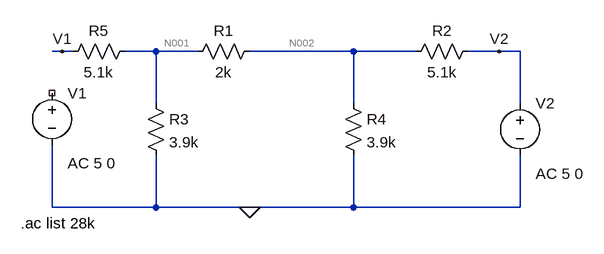
[diagram p0: schematic Draft1.asc]
Draft1.asc, the LTspice schematic file:
Version 4
SHEET 1 880 680
WIRE -32 48 -48 48
WIRE -16 48 -32 48
WIRE 112 48 64 48
WIRE 176 48 112 48
WIRE 416 48 256 48
WIRE 512 48 416 48
WIRE 640 48 592 48
WIRE 672 48 640 48
WIRE 112 128 112 48
WIRE 416 128 416 48
WIRE 672 128 672 48
WIRE -48 288 -48 192
WIRE 112 288 112 208
WIRE 112 288 -48 288
WIRE 256 288 112 288
WIRE 416 288 416 208
WIRE 416 288 256 288
WIRE 672 288 672 208
WIRE 672 288 416 288
FLAG 256 288 0
FLAG -32 48 V1
FLAG 640 48 V2
SYMBOL res 272 32 R90
WINDOW 0 0 56 VBottom 2
WINDOW 3 32 56 VTop 2
SYMATTR InstName R1
SYMATTR Value 2k
SYMBOL res 608 32 R90
WINDOW 0 0 56 VBottom 2
WINDOW 3 32 56 VTop 2
SYMATTR InstName R2
SYMATTR Value 5.1k
SYMBOL res 96 112 R0
SYMATTR InstName R3
SYMATTR Value 3.9k
SYMBOL res 400 112 R0
SYMATTR InstName R4
SYMATTR Value 3.9k
SYMBOL res -32 64 R270
WINDOW 0 32 56 VTop 2
WINDOW 3 0 56 VBottom 2
SYMATTR InstName R5
SYMATTR Value 5.1k
SYMBOL voltage -48 96 R0
WINDOW 123 24 124 Left 2
WINDOW 39 0 0 Left 0
SYMATTR Value2 AC 5 0
SYMATTR InstName V1
SYMATTR Value ""
SYMBOL voltage 672 112 R0
WINDOW 123 24 124 Left 2
WINDOW 39 0 0 Left 0
SYMATTR Value2 AC 5 0
SYMATTR InstName V2
SYMATTR Value ""
TEXT -96 312 Left 2 !.ac list 28k

The netlist it stands for:
* Draft1.asc
R1 N002 N001 2k
R2 V2 N002 5.1k
R3 N001 0 3.9k
R4 N002 0 3.9k
R5 V1 N001 5.1k
V1 NC_01 0 AC 5 0
V2 V2 0 AC 5 0
.ac list 28k
.backanno
.end

* Results of the author's LTspice run, read from the files saved beside the schematic
* AC Analysis:
*   frequency = 28 k
*   V(n002) = 1.576 V
*   V(n001) = 1.042 V
*   V(v2) = 5 V
*   V(v1) = 1.042 V
*   I(R1) = 267.2 µA
*   I(R2) = 671.3 µA
*   I(R3) = 267.2 µA
*   I(R4) = 404.2 µA
*   I(R5) = 0 A
*   I(V1) = 0 A
*   I(V2) = -671.3 µA